# Altium schematic sheet 蓝牙传输.SchDoc: 位置测量
size A4; Author: Xiaowenlg; DrawnBy: Xiaowenlg; Revision: V0.1; SheetNumber: 1; ImagePath: E:\QF_Electronic Development Project\电路图\Heart\logo.bmp
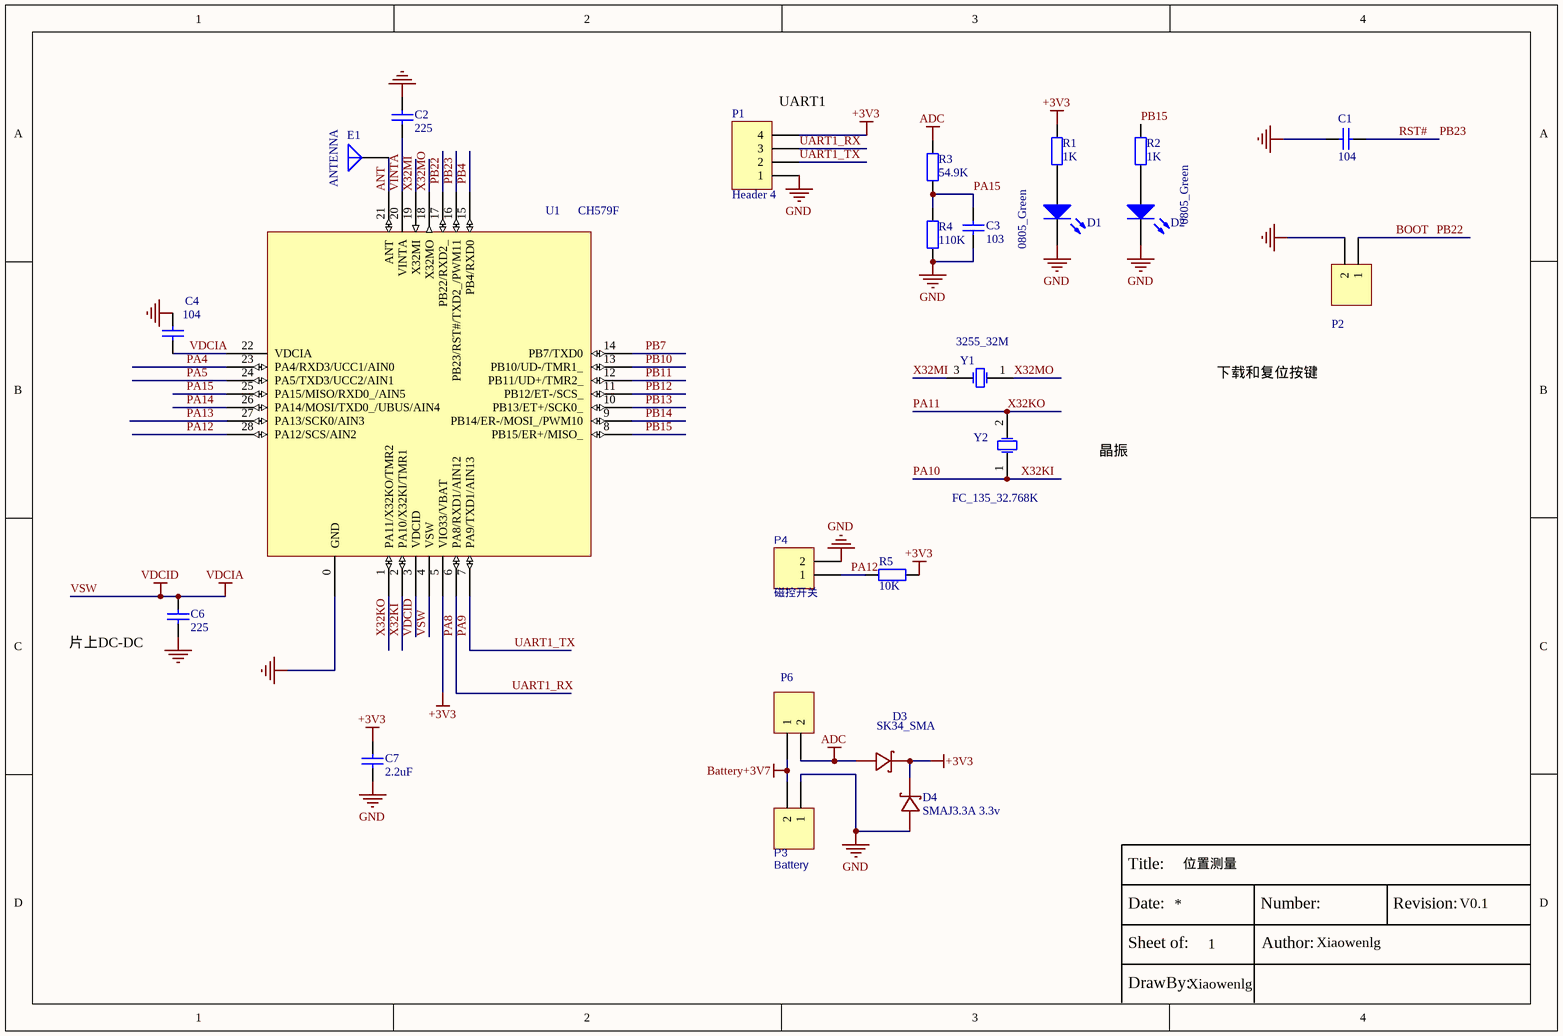
[diagram p0: 蓝牙传输.SchDoc]

## Parts
C1  value 104  [C-RAD-0603]  (hidden comment: Cap)
C2  value 225  [C-RAD-0603]  (hidden comment: Cap)
C3  value 103  [C-RAD-0603]  (hidden comment: Cap)
C4  value 104  [C-RAD-0603]  (hidden comment: Cap)
C6  value 225  [C-RAD-0603]  (hidden comment: Cap)
C7  value 2.2uF  [C-RAD-0805]  (hidden comment: Cap)
D1  value 0805_Green  [LED_0805]  (hidden comment: LED0)
D2  value 0805_Green  [LED_0805]  (hidden comment: LED0)
D3  value SK34_SMA  [SMA_L4.3-W2.6-LS5.2-RD]  (hidden comment: SK34_C65008)
D4  value SMAJ3.3A 3.3v  [SMA_L4.3-W2.6-LS5.2-RD]  (hidden comment: TVS)
E1  ANTENNA  [ANT-F-1-2.4G-1.6]
P1  Header 4  [HDR1X4]
P2  Header 2  [HDR2X1_A]  (value not drawn)
P3  Battery  [XH2.54]
P4  磁控开关  [XH2.54]
P6  Header 2  [HDR2X1_A]  (value not drawn)
R1  1K  [0805-1]
R2  1K  [0805-1]
R3  54.9K  [0805-1]
R4  110K  [0805-1]
R5  10K  [0805-1]
U1  CH579F  [QFN28_4X4]
Y1  value 3255_32M  [3225]  (hidden comment: 32M)
Y2  value FC_135_32.768K  [fc-135]  (hidden comment: 32.768K)

## Nets
+3V3: C7.2 D3.1(K) D4.1(K) P1.4 R1.2 R5.1 U1.5(VIO33/VBAT)
ADC: D3.2(A) P6.2 R3.2
Battery+3V7: P3.2 P6.1
GND: C1.2 C2.2 C3.1 C4.2 C6.1 C7.1 D1.2(K) D2.2(K) D4.2(A) P1.1 P2.2 P3.1 P4.2 R4.1 U1.0(GND)
VDCIA: C4.1 C6.2 U1.3(VDCID) U1.4(VSW) U1.22(VDCIA)  [also labelled VDCID, VSW]
ANT: E1.1(A) U1.21(ANT)
BOOT: P2.1 U1.17(PB22/RXD2_)  [also labelled PB22]
PA4: U1.23(PA4/RXD3/UCC1/AIN0)
PA5: U1.24(PA5/TXD3/UCC2/AIN1)
PA8: P1.3 U1.6(PA8/RXD1/AIN12)  [also labelled UART1_RX]
PA9: P1.2 U1.7(PA9/TXD1/AIN13)  [also labelled UART1_TX]
PA10: U1.2(PA10/X32KI/TMR1) Y2.1(OSC1)  [also labelled X32KI]
PA11: U1.1(PA11/X32KO/TMR2) Y2.2(OSC2)  [also labelled X32KO]
PA12: P4.1 R5.2 U1.28(PA12/SCS/AIN2)
PA13: U1.27(PA13/SCK0/AIN3)
PA14: U1.26(PA14/MOSI/TXD0_/UBUS/AIN4)
PA15: C3.2 R3.1 R4.2 U1.25(PA15/MISO/RXD0_/AIN5)
PB4: U1.15(PB4/RXD0)
PB7: U1.14(PB7/TXD0)
PB10: U1.13(PB10/UD-/TMR1_)
PB11: U1.12(PB11/UD+/TMR2_)
PB12: U1.11(PB12/ET-/SCS_)
PB13: U1.10(PB13/ET+/SCK0_)
PB14: U1.9(PB14/ER-/MOSI_/PWM10)
PB15: R2.2 U1.8(PB15/ER+/MISO_)
PB23: C1.1 U1.16(PB23/RST#/TXD2_/PWM11)  [also labelled RST#]
VINTA: C2.1 U1.20(VINTA)
X32MI: U1.19(X32MI) Y1.3(OSC2)
X32MO: U1.18(X32MO) Y1.1(OSC1)
NetD1_1: D1.1(A) R1.1
NetD2_1: D2.1(A) R2.1

## Notes on the sheet
- (near P1) UART1
- 下载和复位按键
- 晶振
- 片上DC-DC
- Title:
- Date:
- Number:
- Revision:
- DrawBy:
- Sheet of:
- Author:

## Library data of the parts
C1-C4 C6 C7 = Cap: 无极性电容; Published: 8-Jun-2000; LatestRevisionDate: 17-Jul-2002; LatestRevisionNote: Re-released for DXP Platform.; PackageReference: RAD-0.3; Publisher: Altium Limited
D1 D2 = LED0: 发光二极管; Published: 8-Jun-2000; LatestRevisionDate: 08-Jul-2005; LatestRevisionNote: Mech Layer 1 removed.; PackageReference: LED-0; Publisher: Altium Limited
D3 = SK34_C65008: 快恢复二极管; BOM_Manufacturer Part: SK34; BOM_Manufacturer: MDD; SMT Type: Extend; BOM_Supplier: LCSC; image: //image.lceda.cn/szlcsc/C65008.jpg; BOM_Supplier Part: C65008; BOM_LCSC Assembly: Yes; spicePre: D; spiceSymbolName: SK34_C65008
D4 = SK34_C65008: TVS二极管; BOM_Manufacturer Part: SK34; BOM_Manufacturer: MDD; SMT Type: Extend; 描述作用: TVS二极管; image: //image.lceda.cn/szlcsc/C65008.jpg; BOM_Supplier Part: C65008; BOM_LCSC Assembly: Yes; spicePre: D; spiceSymbolName: SK34_C65008
E1 = ANTENNA: Generic Antenna; Value: PCB天线
P1 = Header 4: Header, 4-Pin; LatestRevisionDate: 17-Jul-2002; LatestRevisionNote: Re-released for DXP Platform.; Publisher: Altium Limited
P2-P4 P6 = Header 2: 接插件; LatestRevisionDate: 17-Jul-2002; LatestRevisionNote: Re-released for DXP Platform.; Publisher: Altium Limited
R1-R5 = Res1: 贴片电阻; Published: 8-Jun-2000; LatestRevisionDate: 17-Jul-2002; LatestRevisionNote: Re-released for DXP Platform.; PackageReference: 0603; Publisher: Altium Limited
  R1 R2: Value: 1K
  R3: Value: 54.9K
  R4: Value: 110K
  R5: Value: 10K
U1 = CH579F: MCU+BLE
Y1 Y2 = XTAL: Crystal Oscillator(晶振); Published: 8-Jun-2000; LatestRevisionDate: 17-Jul-2002; LatestRevisionNote: Re-released for DXP Platform.; PackageReference: R38; Publisher: Altium Limited; PackageDescription: Crystal, Thru-Hole; 2 Leads; Body 3.1 x 8.2 mm (Dia.xH)